# EAGLE schematic RJ12_UNO_shield (EAGLE 7.4.0)
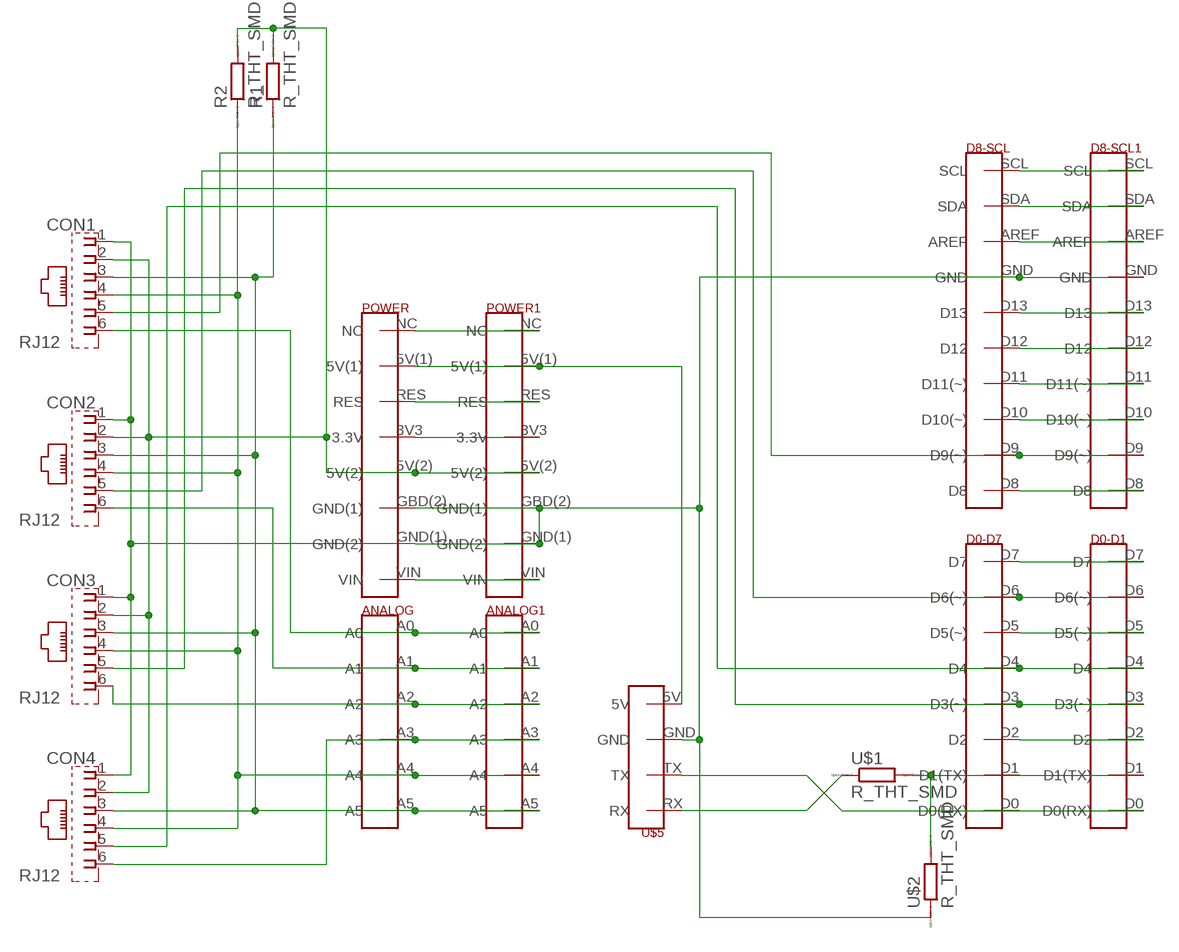
[diagram p0: schematic, sheet 1]

## Parts
ANALOG  ANALOG  [ANALOG]
ANALOG1  ANALOG  [ANALOG]
CON1  RJ12  [RJ12]
CON2  RJ12  [RJ12]
CON3  RJ12  [RJ12]
CON4  RJ12  [RJ12]
D0-D1  DIGITAL0-7  [DIGITAL0-7]
D0-D7  DIGITAL0-7  [DIGITAL0-7]
D8-SCL  DIGITAL8-SCL  [DIGITAL8-SCL]
D8-SCL1  DIGITAL8-SCL  [DIGITAL8-SCL]
POWER  POWER  [POWER]
POWER1  POWER  [POWER]
R1  R_THT_SMD  [R_THT_SMD]
R2  R_THT_SMD  [R_THT_SMD]
U$1  R_THT_SMD  [R_THT_SMD]
U$2  R_THT_SMD  [R_THT_SMD]
U$5  BLUETOOTH  [BLUETOOTH]

## Nets
GND: CON1.1 CON2.1 CON3.1 CON4.1 D8-SCL1.GND D8-SCL.GND POWER1.GBD(2)(GND(1)) POWER1.GND(1)(GND(2)) POWER.GBD(2)(GND(1)) POWER.GND(1)(GND(2)) U$2.1A U$2.1B U$5.GND
N$1: ANALOG1.A5 ANALOG.A5 CON1.3 CON2.3 CON3.3 CON4.3 R1.1A R1.1B
N$2: ANALOG1.A4 ANALOG.A4 CON1.4 CON2.4 CON3.4 CON4.4 R2.1A R2.1B
N$3: CON2.5 D0-D1.D6(D6(~)) D0-D7.D6(D6(~))
N$4: ANALOG1.A2 ANALOG.A2 CON3.6
N$5: ANALOG1.A1 ANALOG.A1 CON2.6
N$6: ANALOG1.A0 ANALOG.A0 CON1.6
N$7: POWER1.NC POWER.NC
N$8: POWER1.RES POWER.RES
N$9: POWER1.3V3(3.3V) POWER.3V3(3.3V)
N$11: POWER1.VIN POWER.VIN
N$12: D8-SCL1.SCL D8-SCL.SCL
N$13: POWER1.5V(1) POWER.5V(1) U$5.5V
N$14: D8-SCL1.SDA D8-SCL.SDA
N$15: D0-D1.D0(D0(RX)) D0-D7.D0(D0(RX)) U$5.TX
N$16: U$1.1A U$1.1B U$5.RX
N$17: D8-SCL1.AREF D8-SCL.AREF
N$18: CON4.5 D0-D1.D4 D0-D7.D4
N$19: D8-SCL1.D13 D8-SCL.D13
N$20: CON3.5 D0-D1.D3(D3(~)) D0-D7.D3(D3(~))
N$21: D0-D1.D1(D1(TX)) D0-D7.D1(D1(TX)) U$1.2A U$1.2B U$2.2A U$2.2B
N$22: D8-SCL1.D12 D8-SCL.D12
N$23: D8-SCL1.D11(D11(~)) D8-SCL.D11(D11(~))
N$24: CON1.5 D8-SCL1.D9(D9(~)) D8-SCL.D9(D9(~))
N$25: D8-SCL1.D10(D10(~)) D8-SCL.D10(D10(~))
N$26: D8-SCL1.D8 D8-SCL.D8
N$27: D0-D1.D7 D0-D7.D7
N$29: D0-D1.D2 D0-D7.D2
N$30: ANALOG1.A3 ANALOG.A3 CON4.6
N$31: CON1.2 CON2.2 CON3.2 CON4.2 POWER1.5V(2) POWER.5V(2) R1.2A R1.2B R2.2A R2.2B
N$33: D0-D1.D5(D5(~)) D0-D7.D5(D5(~))

## Library data of the parts
ANALOG ANALOG1 = AtoG:ANALOG
CON1-CON4 = AtoG:RJ12
D0-D1 D0-D7 = AtoG:DIGITAL0-7
D8-SCL D8-SCL1 = AtoG:DIGITAL8-SCL
POWER POWER1 = AtoG:POWER
R1 R2 U$1 U$2 = AtoG:R_THT_SMD
U$5 = AtoG:BLUETOOTH